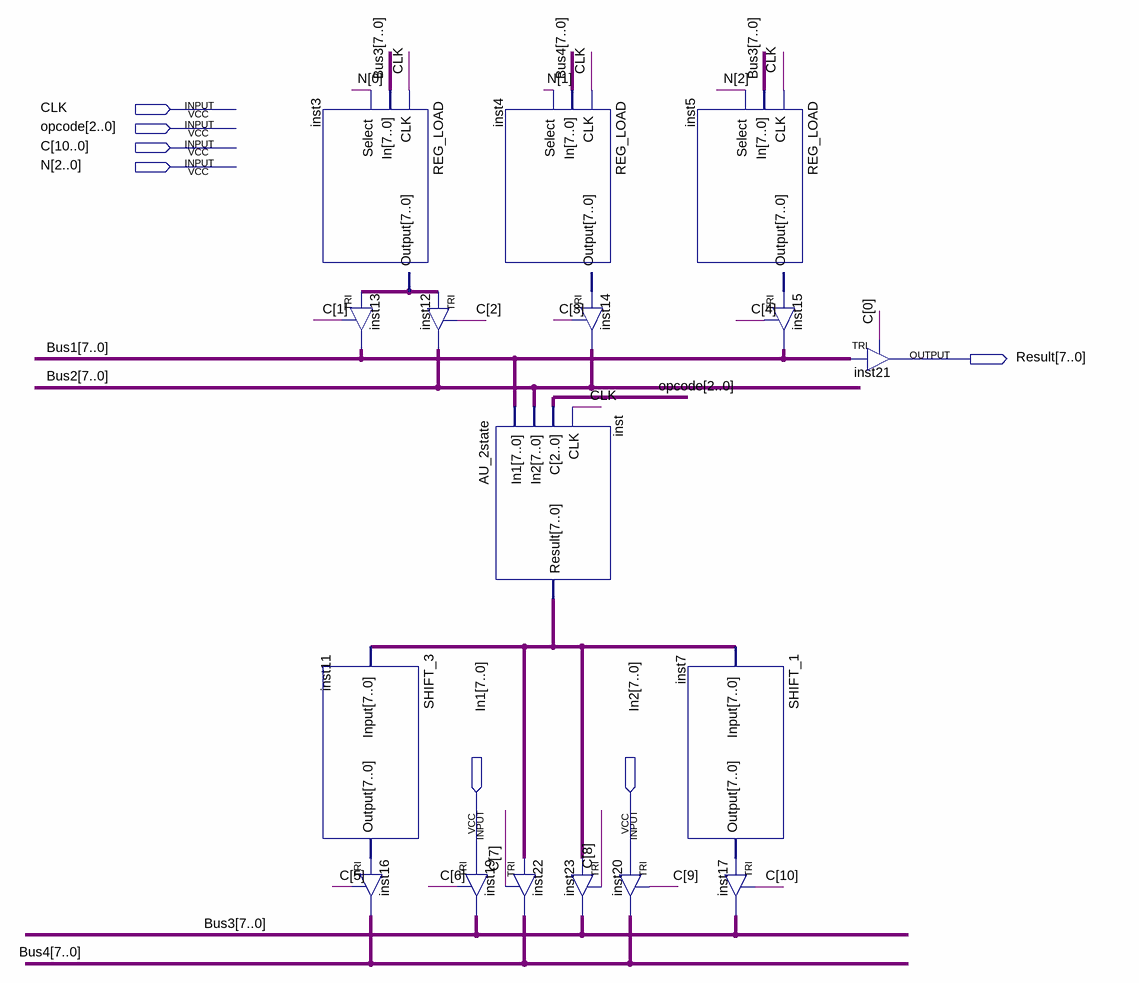
[diagram p0: schematic sheet]
// Quartus schematic Datapath_ver5.bdf as structural Verilog: 17 symbols, 7 pins
module Datapath_ver5 (
  input  CLK,
  input  [2:0] opcode,
  input  [10:0] C,
  input  [2:0] N,
  input  [7:0] In1,
  input  [7:0] In2,
  output [7:0] Result
);

  wire [7:0] Bus1, Bus2, Bus3, Bus4, inst3_output, inst4_output, inst5_output, inst7_output, inst11_output,
       inst_result;

  REG_LOAD inst3 (.CLK(CLK), .In(Bus3), .Select(N[0]), .Output(inst3_output));
  SHIFT_3 inst11 (.Input(inst_result), .Output(inst11_output));
  TRI inst13[7:0] (.IN(inst3_output), .OE(C[1]), .OUT(Bus1));
  TRI inst16[7:0] (.IN(inst11_output), .OE(C[5]), .OUT(Bus4));
  TRI inst12[7:0] (.IN(inst3_output), .OE(C[2]), .OUT(Bus2));
  AU_2state inst (.In1(Bus1), .In2(Bus2), .C(opcode), .CLK(CLK), .Result(inst_result));
  TRI inst19[7:0] (.IN(In1), .OE(C[6]), .OUT(Bus3));
  REG_LOAD inst4 (.CLK(CLK), .In(Bus4), .Select(N[1]), .Output(inst4_output));
  TRI inst22[7:0] (.IN(inst_result), .OE(C[7]), .OUT(Bus4));
  TRI inst14[7:0] (.IN(inst4_output), .OE(C[3]), .OUT(Bus2));
  TRI inst20[7:0] (.IN(In2), .OE(C[9]), .OUT(Bus4));
  TRI inst23[7:0] (.IN(inst_result), .OE(C[8]), .OUT(Bus3));
  REG_LOAD inst5 (.CLK(CLK), .In(Bus3), .Select(N[2]), .Output(inst5_output));
  SHIFT_1 inst7 (.Input(inst_result), .Output(inst7_output));
  TRI inst15[7:0] (.IN(inst5_output), .OE(C[4]), .OUT(Bus1));
  TRI inst17[7:0] (.IN(inst7_output), .OE(C[10]), .OUT(Bus3));
  TRI inst21[7:0] (.IN(Bus1), .OE(C[0]), .OUT(Result));
endmodule
